# Altium project PCB_Project.PrjPcb
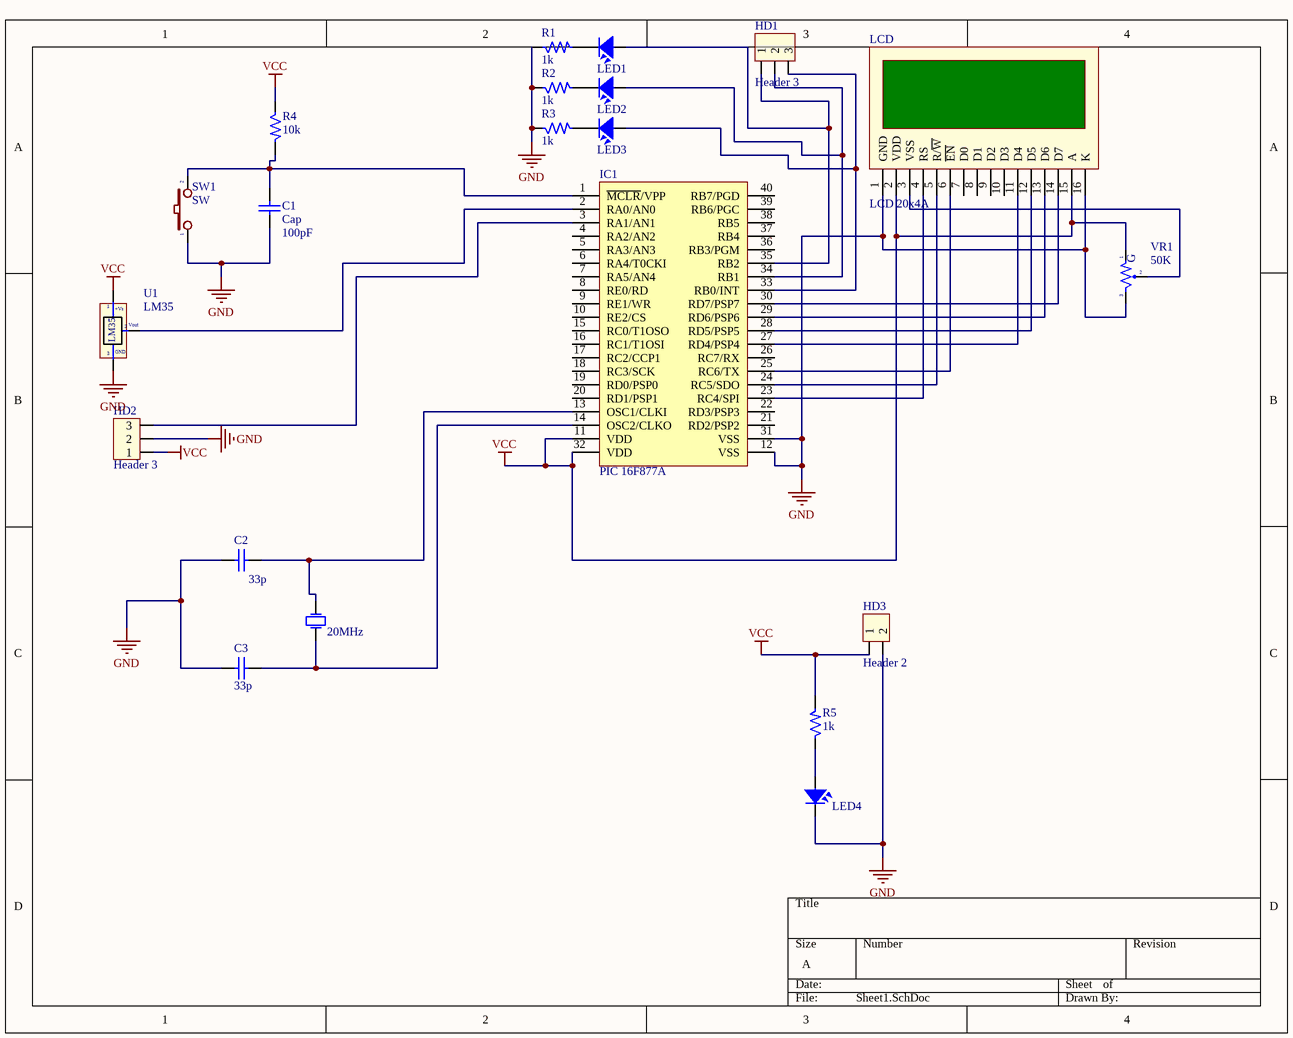
[diagram p0: Sheet1.SchDoc]
1 sheet, 21 parts. Net scope: global (net labels, ports and power ports of the same name join across sheets).
Board file: PCB1.PcbDoc

## Sheet Sheet1.SchDoc
size A

### Parts
C1  Cap  value 100pF  [RAD-0.3]
C2  value 33p  [Tu-ceramic]  (hidden comment: Capacitor Ceramic)
C3  value 33p  [Tu-ceramic]  (hidden comment: Capacitor Ceramic)
HD1  Header 3  [HED3]
HD2  Header 3  [HED3]
HD3  Header 2  [HED2]
IC1  PIC 16F877A  [DIP40/W0.6]
LCD  LCD 20x4A  [LCD20X4A]
LED1  LED  [LED-3]  (value not drawn)
LED2  LED  [LED-3]  (value not drawn)
LED3  LED  [LED-3]  (value not drawn)
LED4  LED  [LED-3]  (value not drawn)
R1  1k  [R1/6W]
R2  1k  [R1/6W]
R3  1k  [R1/6W]
R4  10k  [AXIAL-0.5]
R5  1k  [R1/6W]
SW1  SW  [SW2]
U1  LM35  [TO92-123]
VR1  50K  [VR-S1]
Y1  20MHz  [XT2]

### Nets
GND: C1.1 C2.1 C3.1 HD2.2 HD3.2 IC1.12(VSS) IC1.31(VSS) LCD.1(GND) LCD.16(K) LED4.2 R1.1 R2.1 R3.1 SW1.1 U1.3(-) VR1.3
VCC: HD2.1 HD3.1 IC1.11(VDD) IC1.32(VDD) LCD.2(VDD) LCD.15(A) R4.1 R5.2 U1.1(+Vs) VR1.1
NetC1_2: C1.2 IC1.1(~{MCLR}/VPP) R4.2 SW1.2
NetC2_2: C2.2 IC1.13(OSC1/CLKI) Y1.2(OSC2)
NetC3_2: C3.2 IC1.14(OSC2/CLKO) Y1.1(OSC1)
NetHD1_1: HD1.1 IC1.35(RB2) LED1.1
NetHD1_2: HD1.2 IC1.34(RB1) LED2.1
NetHD1_3: HD1.3 IC1.33(RB0/INT) LED3.1
NetHD2_3: HD2.3 IC1.3(RA1/AN1)
NetIC1_2: IC1.2(RA0/AN0) U1.2(Vout)
NetIC1_23: IC1.23(RC4/SPI) LCD.4(RS)
NetIC1_24: IC1.24(RC5/SDO) LCD.5(R/~{W})
NetIC1_25: IC1.25(RC6/TX) LCD.6(~{EN})
NetIC1_27: IC1.27(RD4/PSP4) LCD.11(D4)
NetIC1_28: IC1.28(RD5/PSP5) LCD.12(D5)
NetIC1_29: IC1.29(RD6/PSP6) LCD.13(D6)
NetIC1_30: IC1.30(RD7/PSP7) LCD.14(D7)
NetLCD_3: LCD.3(VSS) VR1.2
NetLED1_2: LED1.2 R1.2
NetLED2_2: LED2.2 R2.2
NetLED3_2: LED3.2 R3.2
NetLED4_1: LED4.1 R5.1

Not connected (* = marked no-connect by the designer): IC1 4(RA2/AN2) 5(RA3/AN3) 6(RA4/T0CKI) 7(RA5/AN4) 8(RE0/RD) 9(RE1/WR) 10(RE2/CS) 15(RC0/T1OSO) 16(RC1/T1OSI) 17(RC2/CCP1) 18(RC3/SCK) 19(RD0/PSP0) 20(RD1/PSP1) 21(RD2/PSP2) 22(RD3/PSP3) 26(RC7/RX) 36(RB3/PGM) 37(RB4) 38(RB5) 39(RB6/PGC) 40(RB7/PGD); LCD 7(D0) 8(D1) 9(D2) 10(D3)

### Notes on the sheet
- (in symbol LM35) GND
- (in symbol VR-S) G

### Library data of the parts
C1 = Cap: Capacitor; Published: 8-Jun-2000; LatestRevisionDate: 17-Jul-2002; LatestRevisionNote: Re-released for DXP Platform.; PackageReference: RAD-0.3; Publisher: Altium Limited; PackageDescription: Radial Cap, Thru-Hole; 2 Leads; 0.3 in Pin Spacing
C2 C3 = CapDecop: Capacitor; Published: 8-Jun-2000; LatestRevisionDate: 17-Jul-2002; LatestRevisionNote: Re-released for DXP Platform.; PackageReference: RAD-0.3; Publisher: Altium Limited
HD1 HD2 = Hed3: Header 3 (Green); Value: Header 3
HD3 = Hed2: Header 2 (Green); Value: Header 2
IC1 = PIC16F877-PU: 8K FLASH, 368B RAM, 256B EFROM; Value: DIP 40; Value: PIC16F877A; Copyright by: VanDungEvn
LCD = LCD20x4A: LCD dipslay 20 char, 4 line; Value: Jum 40; Value: LCD 20x4A
LED1-LED4 = LED: LED Single colour Green and Red; Value: LED 3 ly Single Colour
R1-R3 R5 = Res: Resistor 1/4W; Value: R1/4W - 1K
R4 = R: Resistor 1/4W; Value: R1/4W - 1K
SW1 = SW2: Switch button 2 pin; Value: SW chip 2 pin
U1 = LM35: Teminal; Value: LM35
VR1 = VR-S: Var Resistor; Value: Volume 50k
Y1 = Crystal: Crystal Oscillator; Published: 8-Jun-2000; LatestRevisionDate: 17-Jul-2002; LatestRevisionNote: Re-released for DXP Platform.; PackageReference: R38; Publisher: Altium Limited